# EAGLE design pci-con (EAGLE 9.3.0)
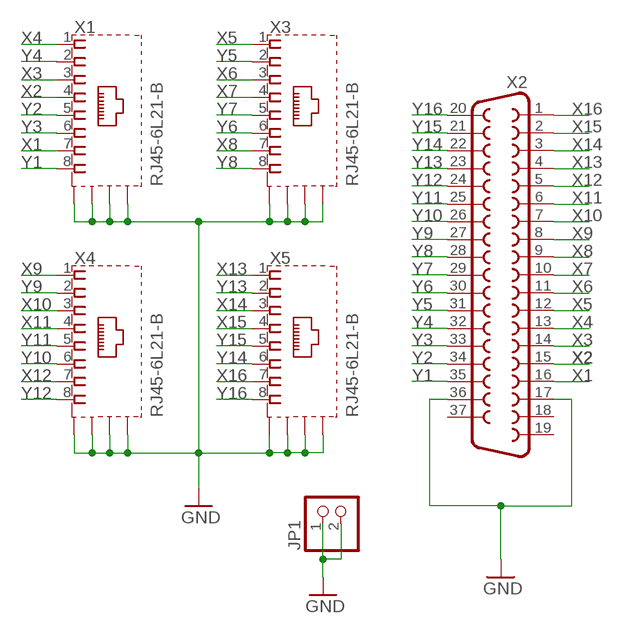
[diagram p0: schematic, sheet 1]

## Parts
JP1  PINHD-1X2  [1X02]
X1  RJ45-6L21-B  [RJ45-SHIELD1]
X2  F37HP  [F37HP]
X3  RJ45-6L21-B  [RJ45-SHIELD1]
X4  RJ45-6L21-B  [RJ45-SHIELD1]
X5  RJ45-6L21-B  [RJ45-SHIELD1]

## Nets
GND: JP1.1 JP1.2 X1.S1(S) X1.S2(S) X1.S3(S) X1.S4(S) X2.17 X2.36 X3.S1(S) X3.S2(S) X3.S3(S) X3.S4(S) X4.S1(S) X4.S2(S) X4.S3(S) X4.S4(S) X5.S1(S) X5.S2(S) X5.S3(S) X5.S4(S)
X1: X1.7 X2.16
X2: X1.4 X2.15
X3: X1.3 X2.14
X4: X1.1 X2.13
X5: X2.12 X3.1
X6: X2.11 X3.3
X7: X2.10 X3.4
X8: X2.9 X3.7
X9: X2.8 X4.1
X10: X2.7 X4.3
X11: X2.6 X4.4
X12: X2.5 X4.7
X13: X2.4 X5.1
X14: X2.3 X5.3
X15: X2.2 X5.4
X16: X2.1 X5.7
Y1: X1.8 X2.35
Y2: X1.5 X2.34
Y3: X1.6 X2.33
Y4: X1.2 X2.32
Y5: X2.31 X3.2
Y6: X2.30 X3.6
Y7: X2.29 X3.5
Y8: X2.28 X3.8
Y9: X2.27 X4.2
Y10: X2.26 X4.6
Y11: X2.25 X4.5
Y12: X2.24 X4.8
Y13: X2.23 X5.2
Y14: X2.22 X5.6
Y15: X2.21 X5.5
Y16: X2.20 X5.8
Unconnected: X2.18 X2.19 X2.37

## Library data of the parts
JP1 = pinhead:PINHD-1X2: PIN HEADER
X1 X3-X5 = con-tycoelectronics:RJ45*2: RJ45 Low Profile Shield Type 2 For all RJ45 L, LC, LCT and X Series Models Source: www.tycoelectronics.com .. ENG_DS_1654001_1099_RJ_L_0507.pdf; OC_FARNELL: unknown; OC_NEWARK: unknown
X2 = con-subd:F37: SUB-D; OC_FARNELL: unknown; OC_NEWARK: unknown

## Board
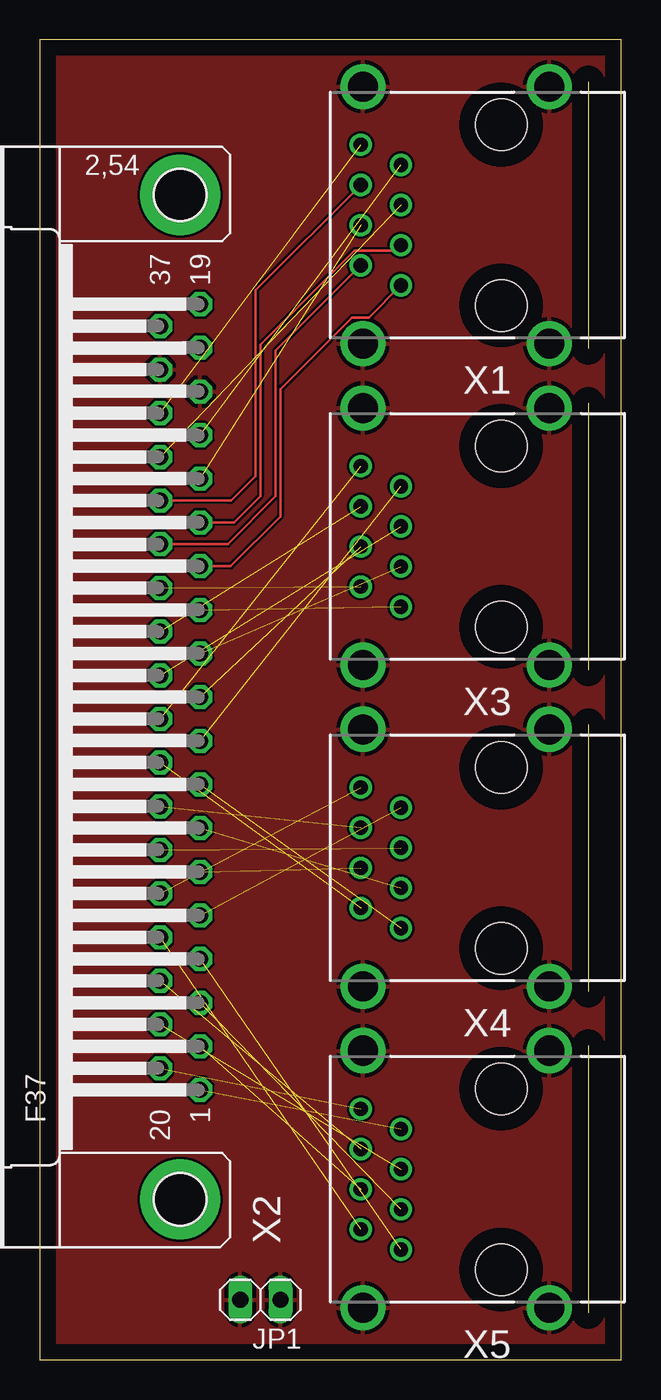
[diagram p1: board, top side]
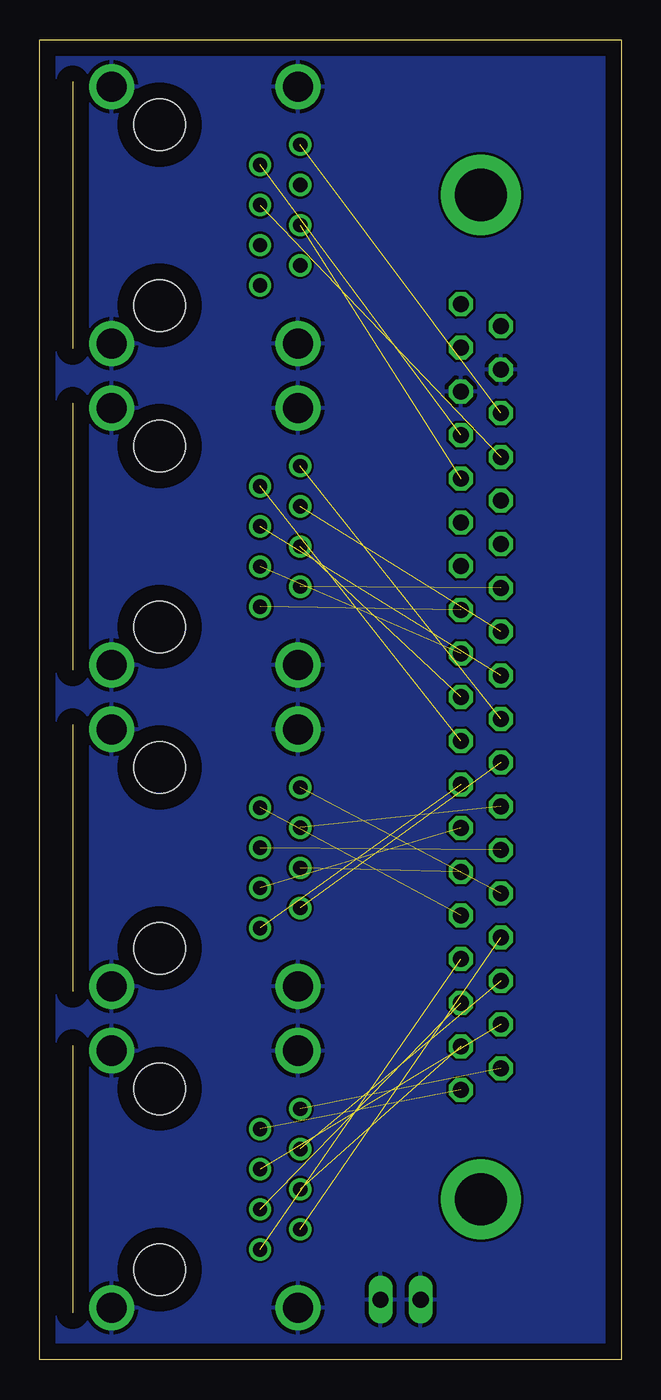
[diagram p2: board, bottom side, seen from below]

Size 36.81 x 83.49 mm. Coordinates in mm from the lower left corner, seen from the top.
Outline: 0,0 36.81,0 36.81,83.49 0,83.49 0,0
Copper layers (1*16): Top 0.035mm / dielectric 1.5mm / Bottom 0.035mm
Design rules "default": minimum track width 6mil, minimum drill 0.35mm, track to track 6mil, track to pad 6mil, pad to pad 6mil, via to via 6mil, smd to smd 6mil, copper to edge 40mil, drill to drill 6mil, minimum pad ring 10mil, minimum via ring 8mil, stop-mask expansion 4mil, vias tented up to drill 0mil, thermal gap 10mil

### Footprints (pad centres in the part's own frame; a part is rotated, then mirrored left to right if it is on the bottom)
1X02 = drill 1.016 long: 1 -1.27,0; 2 1.27,0
RJ45-SHIELD1 = drill 0.9 pad 1.4: 1 -4.445,6.35; 2 -3.175,8.89; 3 -1.905,6.35; 4 -0.635,8.89; 5 0.635,6.35; 6 1.905,8.89; 7 3.175,6.35; 8 4.445,8.89 | drill 1.9 pad 2.5: S1 -8.128,-3.048; S2 8.128,-3.048; S3 -8.128,8.76; S4 8.128,8.76 | hole 3.251: -5.715,0; 5.715,0
F37HP = drill 1.016 octagon: 1 -24.841,-1.27; 2 -22.073,-1.27; 3 -19.329,-1.27; 4 -16.561,-1.27; 5 -13.792,-1.27; 6 -11.049,-1.27; 7 -8.28,-1.27; 8 -5.512,-1.27; 9 -2.769,-1.27; 10 0,-1.27; 11 2.769,-1.27; 12 5.512,-1.27; 13 8.28,-1.27; 14 11.049,-1.27; 15 13.818,-1.27; 16 16.561,-1.27; 17 19.329,-1.27; 18 22.098,-1.27; 19 24.841,-1.27; 20 -23.47,1.27; 21 -20.701,1.27; 22 -17.932,1.27; 23 -15.189,1.27; 24 -12.421,1.27; 25 -9.652,1.27; 26 -6.909,1.27; 27 -4.14,1.27; 28 -1.372,1.27; 29 1.372,1.27; 30 4.14,1.27; 31 6.909,1.27; 32 9.677,1.27; 33 12.421,1.27; 34 15.189,1.27; 35 17.958,1.27; 36 20.701,1.27; 37 23.47,1.27 | drill 3.302 pad 5.08: G1 -31.75,0; G2 31.75,0

### Placement (x,y rotation side)
JP1  13.97,3.81 180 top
X1  29.21,72.39 90 top
X2  8.89,41.91 90 top
X3  29.21,52.07 90 top
X4  29.21,31.75 90 top
X5  29.21,11.43 90 top

### Tracks (layer width: path | path; a pad name or v marks a point on that pad's centre or on a via)
GND
  pour Top: -2.54,85.09 48.26,85.09 50.8,82.55 50.8,1.27 44.45,-5.08 3.81,-5.08 -3.81,2.54 -3.81,83.82
  pour Bottom: -8.89,83.82 -5.08,87.63 5.08,87.63 49.53,87.63 54.61,82.55 54.61,6.35 46.99,-1.27 -5.08,-1.27 -7.62,1.27 -7.62,82.55
X1  (1 unrouted)
X2  (1 unrouted)
X3
  Top 0.152: X1.3 22.52,70.15 19.93,70.15 13.97,64.18 13.97,54.61 12.32,52.96 X2.14
X4
  Top 0.152: X1.1 20.83,65.92 19.77,65.92 15.24,61.39 15.24,53.34 12.09,50.19 X2.13
X5  (1 unrouted)
X6  (1 unrouted)
X7  (1 unrouted)
X8  (1 unrouted)
X9  (1 unrouted)
X10  (1 unrouted)
X11  (1 unrouted)
X12  (1 unrouted)
X13  (1 unrouted)
X14  (1 unrouted)
X15  (1 unrouted)
X16  (1 unrouted)
Y1  (1 unrouted)
Y2  (1 unrouted)
Y3
  Top 0.152: X1.6 13.66,67.64 13.66,55.88 12.12,54.33 X2.33
Y4
  Top 0.152: X1.2 14.94,63.83 14.94,54.61 11.91,51.59 X2.32
Y5  (1 unrouted)
Y6  (1 unrouted)
Y7  (1 unrouted)
Y8  (1 unrouted)
Y9  (1 unrouted)
Y10  (1 unrouted)
Y11  (1 unrouted)
Y12  (1 unrouted)
Y13  (1 unrouted)
Y14  (1 unrouted)
Y15  (1 unrouted)
Y16  (1 unrouted)